# Altium schematic sheet target USB interfaces v3.SchDoc
size A; DocumentNumber: 4; SheetNumber: 4; SheetTotal: 6
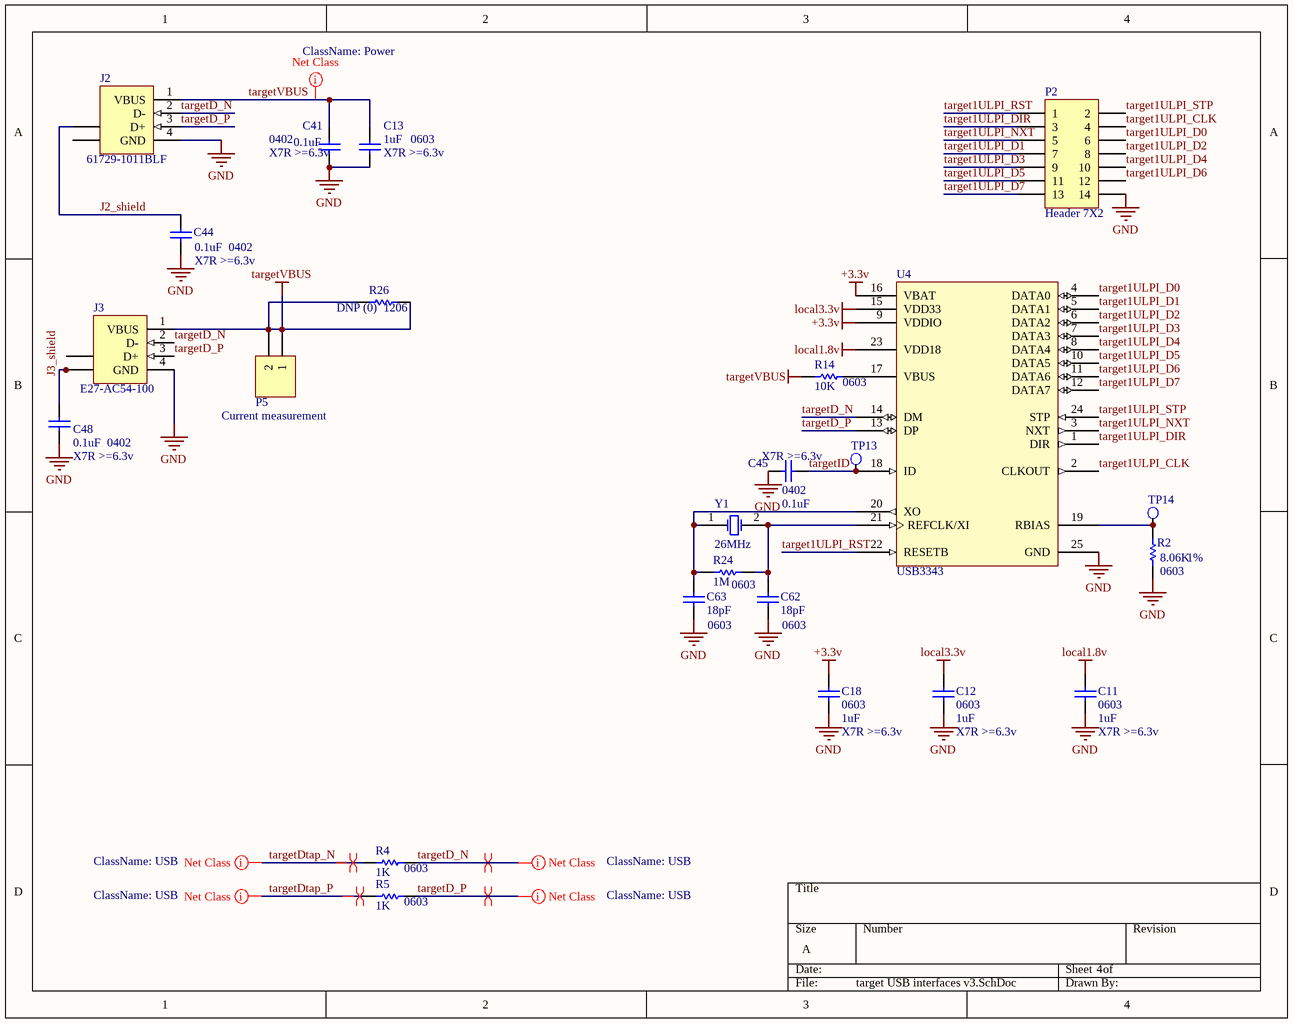
[diagram p0: target USB interfaces v3.SchDoc]

## Parts
C11  value 1uF  PackageReference: 0603  Rating: X7R >=6.3v  [CAPC1608N]  (hidden comment: Cap Semi)
C12  value 1uF  PackageReference: 0603  Rating: X7R >=6.3v  [CAPC1608N]  (hidden comment: Cap Semi)
C13  value 1uF  PackageReference: 0603  Rating: X7R >=6.3v  [CAPC1608N]  (hidden comment: Cap Semi)
C18  value 1uF  PackageReference: 0603  Rating: X7R >=6.3v  [CAPC1608N]  (hidden comment: Cap Semi)
C41  value 0.1uF  PackageReference: 0402  Rating: X7R >=6.3v  [CAPC1005N]  (hidden comment: Cap Semi)
C44  value 0.1uF  PackageReference: 0402  Rating: X7R >=6.3v  [CAPC1005N]  (hidden comment: Cap Semi)
C45  value 0.1uF  PackageReference: 0402  Rating: X7R >=6.3v  [CAPC1005N]  (hidden comment: Cap Semi)
C48  value 0.1uF  PackageReference: 0402  Rating: X7R >=6.3v  [CAPC1005N]  (hidden comment: Cap Semi)
C62  value 18pF  PackageReference: 0603  [CAPC1608N]  (hidden comment: Cap Semi)
C63  value 18pF  PackageReference: 0603  [CAPC1608N]  (hidden comment: Cap Semi)
J2  value 61729-1011BLF  [1-1470156]  (hidden comment: 1-1470156-1)
J3  value E27-AC54-100  [787616]  (hidden comment: 787616-1)
P2  Header 7X2  [HDR2X7]  (no BOM)
P5  Current measurement  [HDR1X2]  (no BOM)
R2  value 8.06K  PackageReference: 0603  Rating: 1%  [RESC1608N]  (hidden comment: Res Semi)
R4  value 1K  PackageReference: 0603  [RESC1608N]  (hidden comment: Res Semi)
R5  value 1K  PackageReference: 0603  [RESC1608N]  (hidden comment: Res Semi)
R14  value 10K  PackageReference: 0603  [RESC1608N]  (hidden comment: Res Semi)
R24  value 1M  PackageReference: 0603  [RESC1608N]  (hidden comment: Res Semi)
R26  value DNP (0)  PackageReference: 1206  [RESC3216N]  (hidden comment: Res Semi)
TP13  Test Point  [testpoint]  (value not drawn)  (no BOM)
TP14  Test Point  [testpoint]  (value not drawn)  (no BOM)
U4  USB3343  [SMSC USB334x QFN24]
Y1  26MHz  [HC49/4H_SMX]

## Nets
+3.3v: C18.1 U4.9(VDDIO) U4.16(VBAT)
GND: C11.2 C12.2 C13.1 C18.2 C41.1 C44.1 C45.2 C48.1 C62.1 C63.1 J2.4(GND) J3.4(GND) P2.14 R2.1 U4.25(GND)
local1.8v: C11.1 U4.23(VDD18)
local3.3v: C12.1 U4.15(VDD33)
targetVBUS: C13.2 C41.2 J2.1(VBUS) J3.1(VBUS) P5.1 P5.2 R14.2 R26.1 R26.2
J2_shield: C44.2 J2.5(SHLD)
J3_shield: C48.2 J3.6(SHLD)
target1ULPI_CLK: P2.4 U4.2(CLKOUT)
target1ULPI_D0: P2.6 U4.4(DATA0)
target1ULPI_D1: P2.7 U4.5(DATA1)
target1ULPI_D2: P2.8 U4.6(DATA2)
target1ULPI_D3: P2.9 U4.7(DATA3)
target1ULPI_D4: P2.10 U4.8(DATA4)
target1ULPI_D5: P2.11 U4.10(DATA5)
target1ULPI_D6: P2.12 U4.11(DATA6)
target1ULPI_D7: P2.13 U4.12(DATA7)
target1ULPI_DIR: P2.3 U4.1(DIR)
target1ULPI_NXT: P2.5 U4.3(NXT)
target1ULPI_RST: P2.1 U4.22(RESETB)
target1ULPI_STP: P2.2 U4.24(STP)
targetD_N: J2.2(D-) J3.2(D-) R4.1 U4.14(DM)
targetD_P: J2.3(D+) J3.3(D+) R5.1 U4.13(DP)
targetDtap_N: R4.2
targetDtap_P: R5.2
targetID: C45.1 TP13.1(pin) U4.18(ID)
NetC62_2: C62.2 R24.1 U4.21(REFCLK/XI) Y1.2(OSC2)
NetC63_2: C63.2 R24.2 U4.20(XO) Y1.1(OSC1)
NetR2_2: R2.2 TP14.1(pin) U4.19(RBIAS)
NetR14_1: R14.1 U4.17(VBUS)

Not connected (* = marked no-connect by the designer): J2 6(SHLD); J3 5(SHLD)

## Layout directives
net class Power: targetVBUS
differential pair: targetD_N, targetD_P, targetDtap_N, targetDtap_P
net class USB: targetD_N, targetD_P, targetDtap_N, targetDtap_P

## Library data of the parts
C11 C12 C18 = Cap Semi: Capacitor (Semiconductor SIM Model); Substitutable: yes; Description: CAP CER 10000PF 6.3V X5R 0201; Tolerance: ±10%; Supplier 1: Digi-Key; Supplier Part Number 1: 445-4703-1-ND
C13 = Cap Semi: Capacitor (Semiconductor SIM Model); Substitutable: yes; Supplier 1: Digi-Key; Supplier Part Number 1: 445-4703-1-ND
C41 C44 C45 C48 = Cap Semi: Capacitor (Semiconductor SIM Model); Substitutable: yes; Tolerance: ±10%; Supplier 1: Digi-Key; Supplier Part Number 1: 445-4703-1-ND; Supplier 2: Digi-Key; Supplier Part Number 2: 445-6854-1-ND
C62 C63 = Cap Semi: Capacitor (Semiconductor SIM Model); Rating: C0G >=6.3v; Substitutable: yes; Supplier 1: Digi-Key; Supplier Part Number 1: 445-1777-1-ND
J2 = 1-1470156-1: USB 1.1, Right Angle, Thru-Hole, B Type, Receptacle, 4 Position, White; Substitutable: no; PackageReference: 1-1470156
J3 = 787616-1: USB 1.1, Right Angle, Thru-Hole, A Type, Receptacle, 4 Position, Black; Substitutable: no
P2 = Header 7X2: Header, 7-Pin, Dual row; Substitutable: DNP
P5 = Header 2: Header, 2-Pin; Substitutable: DNP
R2 = Res Semi: Semiconductor Resistor; Substitutable: yes; Supplier 1: Digi-Key; Supplier Part Number 1: 311-8.06KHRCT-ND
R4 R5 R14 R24 R26 = Res Semi: Semiconductor Resistor; Rating: 5%; Substitutable: yes
TP13 TP14 = Test Pad: Substitutable: DNP
U4 = USB3343: Hi-Speed USB Transceiver with 1.8V-3.3V ULPI Interface - MHz Reference Clock; Substitutable: no; PackageReference: QFN-24; Value: USB3343
Y1 = XTAL: Crystal Oscillator; Substitutable: yes; PackageReference: HS-49; Value: 26 MHz